# Altium schematic sheet FPGA_ADC4.SchDoc
size A4
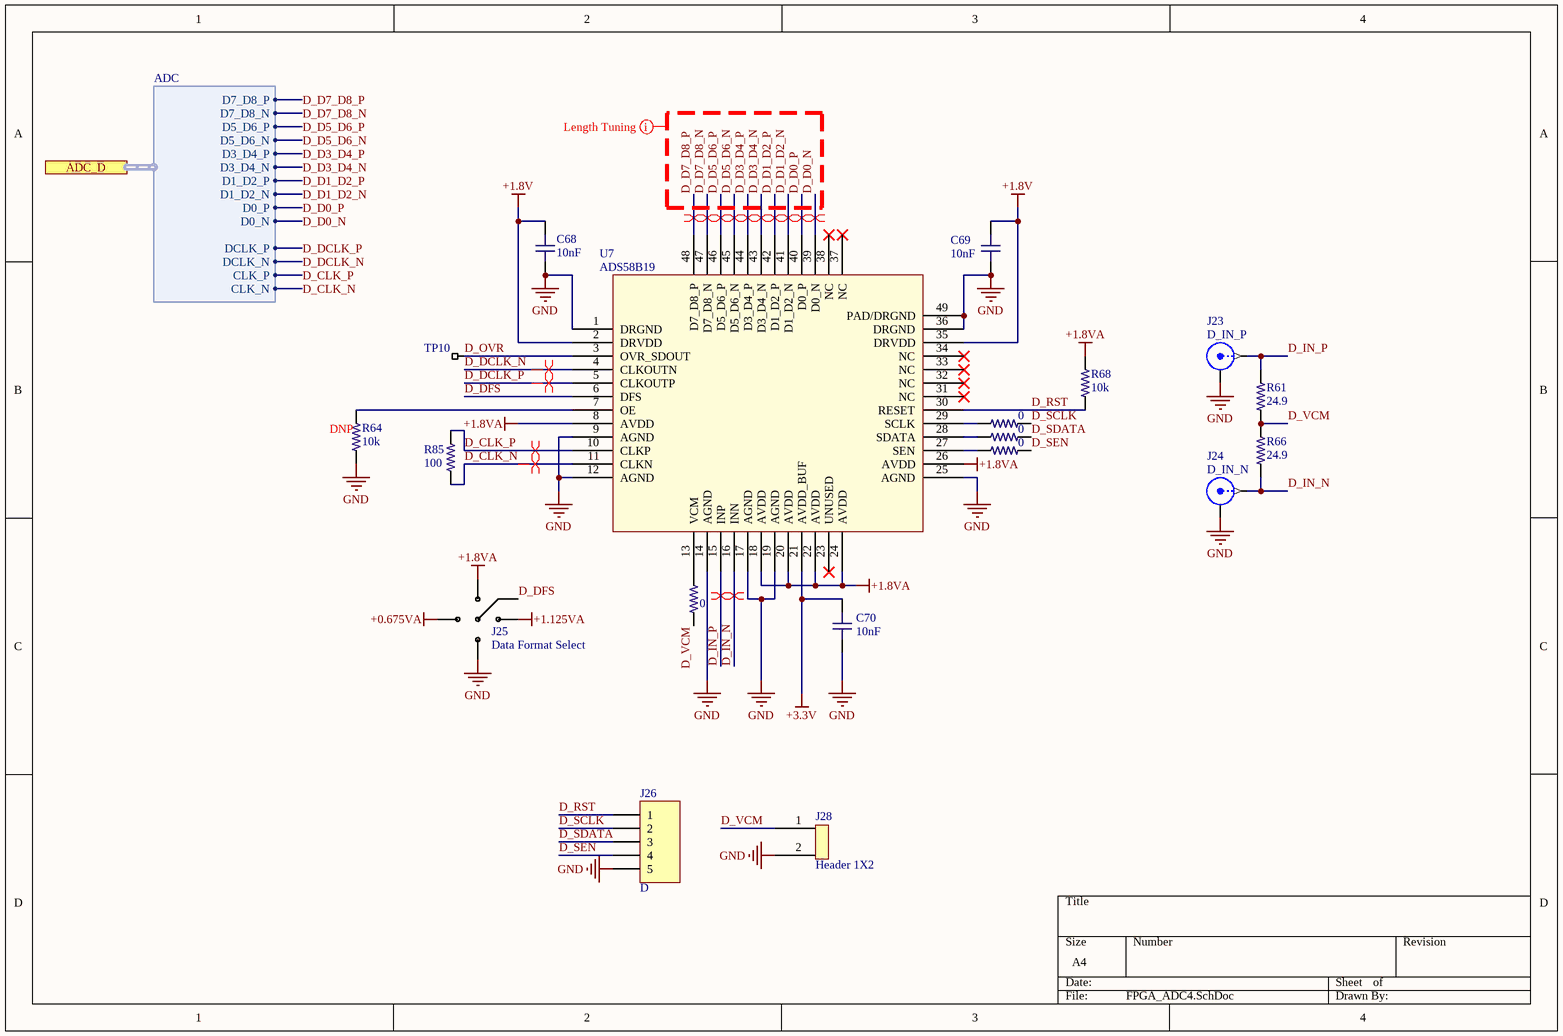
[diagram p0: FPGA_ADC4.SchDoc]

## Parts
C68  value 10nF  [C0603-HIGH-DENSITY]  (hidden comment: C0603 10nF 50V X7R)
C69  value 10nF  [C0603-HIGH-DENSITY]  (hidden comment: C0603 10nF 50V X7R)
C70  value 10nF  [C0603-HIGH-DENSITY]  (hidden comment: C0603 10nF 50V X7R)
J23  D_IN_P  [SMA Edge Launch (Horizontal)]
J24  D_IN_N  [SMA Edge Launch (Horizontal)]
J25  Data Format Select  [4P Jumper]
J26  D  [HDR1X5]
J28  Header 1X2  [Header 1x2 TH Pitch 2.54mm]
R61  value 24.9  [R0603-HIGH-DENSITY]  (hidden comment: RC0603FR-0724R9L)
R62  value 0  [R0603-IPC]  (hidden comment: R0603 0)
R63  value 0  [R0603-IPC]  (hidden comment: R0603 0)
R64  value 10k  [R0603-IPC-10K]  (hidden comment: R0603 10K 1%)
R65  value 0  [R0603-IPC]  (hidden comment: R0603 0)
R66  value 24.9  [R0603-HIGH-DENSITY]  (hidden comment: RC0603FR-0724R9L)
R67  value 0  [R0603-IPC]  (hidden comment: R0603 0)
R68  value 10k  [R0603-IPC-10K]  (hidden comment: R0603 10K 1%)
R85  value 100  [R0402-HIGH-DENSITY]  (hidden comment: R0402 100R 1%)
TP10  Testpoint_SMT  [TESTPOINT_SMT]  (value not drawn)  (no BOM)
U7  ADS58B19  [VQFN48]

## Ports
ADC_D (harness ADC)

## Harnesses
ADC: D7_D8_P, D7_D8_N, D5_D6_P, D5_D6_N, D3_D4_P, D3_D4_N, D1_D2_P, D1_D2_N, D0_P, D0_N, CLK_P, CLK_N, DCLK_P, DCLK_N

## Nets
+0.675VA: J25.4
+1.8V: C68.1 C69.1 U7.2(DRVDD) U7.35(DRVDD)
+1.8VA: J25.1 R68.2 U7.8(AVDD) U7.18(AVDD) U7.20(AVDD) U7.22(AVDD) U7.24(AVDD) U7.26(AVDD)
+1.125VA: J25.2
+3.3V: C70.1 U7.21(AVDD_BUF)
GND: C68.2 C69.2 C70.2 J23.2(Y) J24.2(Y) J25.3 J26.5 J28.2 R64.1 U7.1(DRGND) U7.9(AGND) U7.12(AGND) U7.14(AGND) U7.17(AGND) U7.19(AGND) U7.25(AGND) U7.36(DRGND) U7.49(PAD/DRGND)
D_CLK_N: R85.1 U7.11(CLKN) ; port ADC_D.CLK_N
D_CLK_P: R85.2 U7.10(CLKP) ; port ADC_D.CLK_P
D_D0_N: U7.39(D0_N) ; port ADC_D.D0_N
D_D0_P: U7.40(D0_P) ; port ADC_D.D0_P
D_D1_D2_N: U7.41(D1_D2_N) ; port ADC_D.D1_D2_N
D_D1_D2_P: U7.42(D1_D2_P) ; port ADC_D.D1_D2_P
D_D3_D4_N: U7.43(D3_D4_N) ; port ADC_D.D3_D4_N
D_D3_D4_P: U7.44(D3_D4_P) ; port ADC_D.D3_D4_P
D_D5_D6_N: U7.45(D5_D6_N) ; port ADC_D.D5_D6_N
D_D5_D6_P: U7.46(D5_D6_P) ; port ADC_D.D5_D6_P
D_D7_D8_N: U7.47(D7_D8_N) ; port ADC_D.D7_D8_N
D_D7_D8_P: U7.48(D7_D8_P) ; port ADC_D.D7_D8_P
D_DCLK_N: U7.4(CLKOUTN) ; port ADC_D.DCLK_N
D_DCLK_P: U7.5(CLKOUTP) ; port ADC_D.DCLK_P
D_DFS: J25.5 U7.6(DFS)
D_IN_N: J24.1(X) R66.1 U7.16(INN)
D_IN_P: J23.1(X) R61.2 U7.15(INP)
D_OVR: TP10.1 U7.3(OVR_SDOUT)
D_RST: J26.1 R68.1 U7.30(RESET)
D_SCLK: J26.2 R62.2
D_SDATA: J26.3 R63.2
D_SEN: J26.4 R65.2
D_VCM: J28.1 R61.1 R66.2 R67.2
NetR62_1: R62.1 U7.29(SCLK)
NetR63_1: R63.1 U7.28(SDATA)
NetR64_2: R64.2 U7.7(OE)
NetR65_1: R65.1 U7.27(SEN)
NetR67_1: R67.1 U7.13(VCM)

Not connected (* = marked no-connect by the designer): U7 23(UNUSED)* 31(NC)* 32(NC)* 33(NC)* 34(NC)* 37(NC)* 38(NC)*

## Layout directives
differential pair: D_D0_N, D_D0_P, D_D1_D2_N, D_D1_D2_P, D_D3_D4_N, D_D3_D4_P, D_D5_D6_N, D_D5_D6_P, D_D7_D8_N, D_D7_D8_P
differential pair; differential pair class ADC_CLK: D_CLK_N, D_CLK_P, D_DCLK_N, D_DCLK_P
differential pair; differential pair class AnalogIn: D_IN_N, D_IN_P
net class ADC_DATA - 150mil; net class ADC_DATA_D: D_D0_N, D_D0_P, D_D1_D2_N, D_D1_D2_P, D_D3_D4_N, D_D3_D4_P, D_D5_D6_N, D_D5_D6_P, D_D7_D8_N, D_D7_D8_P

## Notes on the sheet
- (near R64) DNP

## Library data of the parts
C68-C70 = C0603 10nF 50V X7R: CAP CER 10000PF 50V X7R 0603; EIA Code: X7R; Max. Voltage: 50V; Features: Soft Termination; Supplier 1: Digi-Key; Supplier Part Number 1: 490-10892-1-ND
J23 J24 = SMA: SMA Connector; Supplier 1: Digi-Key; Supplier Part Number 1: A97594-ND
J25 = 4P Jumper: 0603 4 Way Solder Jumper
J26 = Header 5: Header, 5-Pin; LatestRevisionDate: 17-Jul-2002; LatestRevisionNote: Re-released for DXP Platform.; Publisher: Altium Limited
R61 R66 = R0603 24.9R 1%: Chip Resistor, 0603, 24.9 ohms, 0.1W; Supplier 1: Digi-Key; Supplier 2: Mouser; Supplier Part Number 1: 311-24.9HRCT-ND; Supplier Part Number 2: 603-RC0603FR-0724R9L
R62 R63 R65 R67 = R0603 0: RES SMD 0 OHM JUMPER 1/10W 0603; Supplier 1: Digi-Key; Supplier Part Number 1: RMCF0603ZT0R00CT-ND
R64 R68 = R0603 10K 1%: RES SMD 10K OHM 1% 1/10W 0603; Supplier 1: Digi-Key; Supplier Part Number 1: RMCF0603FT10K0CT-ND
R85 = R0402 100R 1%: Chip Resistor, 0402, 100 ohms, 1%, 1/16 W; Supplier 1: Digi-Key; Supplier Part Number 1: 311-100LRCT-ND
TP10 = Testpoint_SMT: SMT Test Point
U7 = ADS58B19: Single ADC Pipelined 250Msps 9-bit Parallel/LVDS 48-Pin VQFN; Supplier 1: Digi-Key; Supplier 2: Mouser; Supplier Part Number 1: 296-28296-1-ND; Supplier Part Number 2: 595-ADS58B19IRGZT